# EAGLE design pcb_transformer_4x_balun (EAGLE 9.2.2)
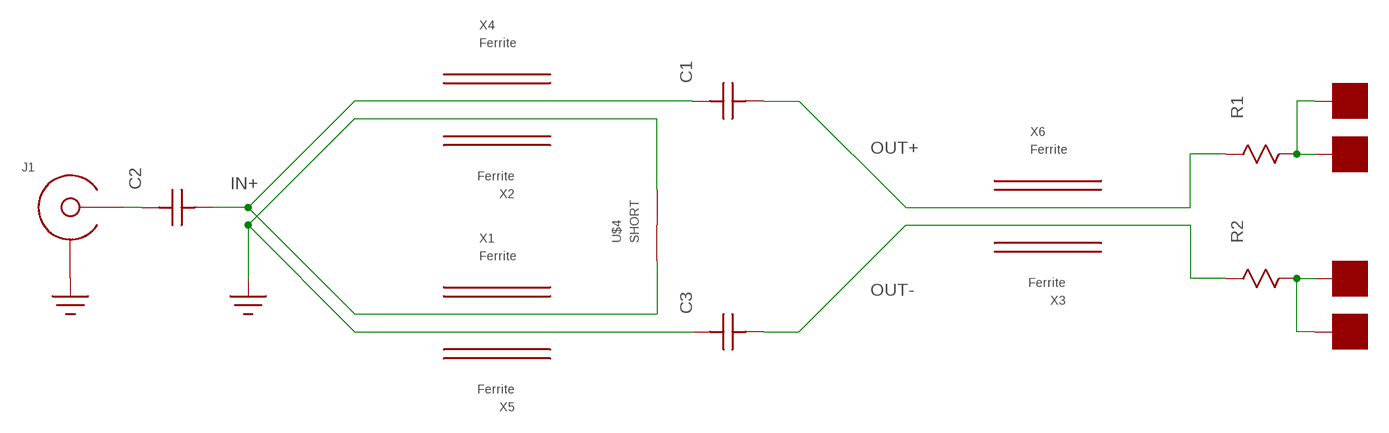
[diagram p0: schematic, sheet 1]

## Parts
C1  C0603  [C0603]
C2  C0603  [C0603]
C3  C0603  [C0603]
J1  EDGE_LAUNCH_JACK  [EDGE_LAUNCH_RF_CON]
R1  R0603  [R0603]
R2  R0603  [R0603]
U$2  PAD50MIL  [PAD_50MIL]
U$4  SHORT  [SHORT_57MIL]
U$5  PAD50MIL  [PAD_50MIL]
U$6  PAD50MIL  [PAD_50MIL]
U$7  PAD50MIL  [PAD_50MIL]
X1  Ferrite  FERRITE_PLATE  [FERRITE-MP0350]
X2  Ferrite  FERRITE_PLATE  [FERRITE-MP0350]
X3  Ferrite  FERRITE_PLATE  [FERRITE-MP0350]
X4  Ferrite  FERRITE_PLATE  [FERRITE-MP0350]
X5  Ferrite  FERRITE_PLATE  [FERRITE-MP0350]
X6  Ferrite  FERRITE_PLATE  [FERRITE-MP0350]

## Nets
GND: C3.P$2 J1.GND@1(SHIELD) J1.GND@2(SHIELD) J1.GND@3(SHIELD) J1.GND@4(SHIELD) J1.GND@5(SHIELD) J1.GND@6(SHIELD) J1.GND@7(SHIELD) J1.GND@8(SHIELD) J1.GND@9(SHIELD) J1.GND@10(SHIELD) J1.GND@11(SHIELD) J1.GND@12(SHIELD) J1.SHIELD@1(SHIELD) J1.SHIELD@2(SHIELD) U$4.P$2
IN+: C1.P$2 C2.P$1 U$4.P$1
N$2: C2.P$2 J1.CENTER
N$6: R1.P$2 U$2.P$1 U$6.P$1
N$7: R2.P$2 U$5.P$1 U$7.P$1
OUT+: C1.P$1 R1.P$1
OUT-: C3.P$1 R2.P$1

## Library data of the parts
C1-C3 = yapo:C
J1 = yapo:EDGE_LAUNCH_JACK
R1 R2 = yapo:R
U$2 U$5-U$7 = yapo:PAD
U$4 = yapo:SHORT
X1-X6 = yapo:FERRITE_PLATE

## Board
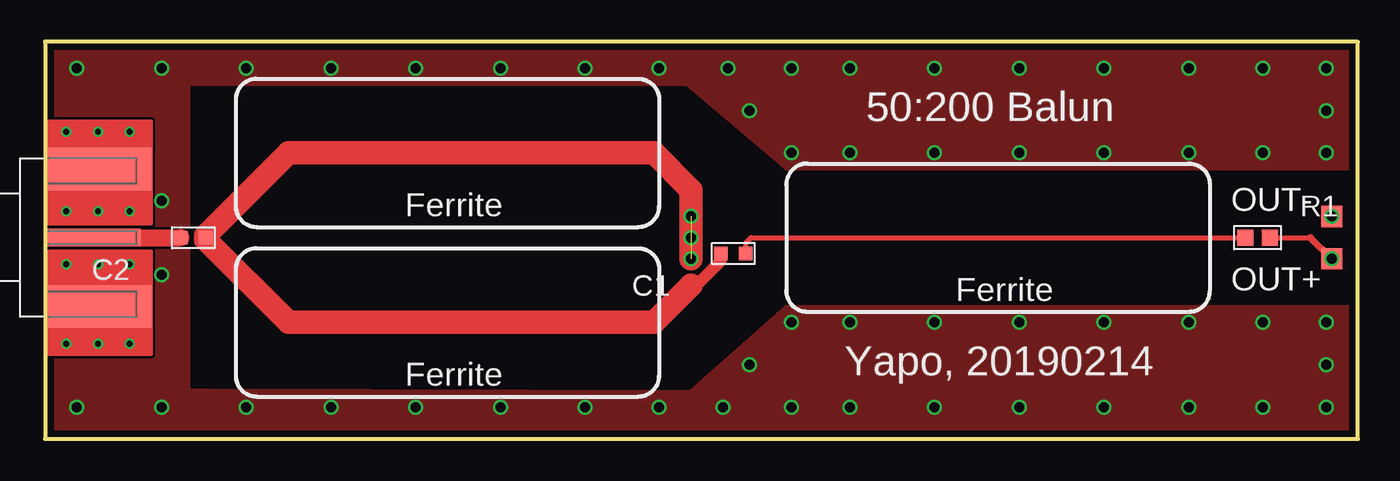
[diagram p1: board, top side]
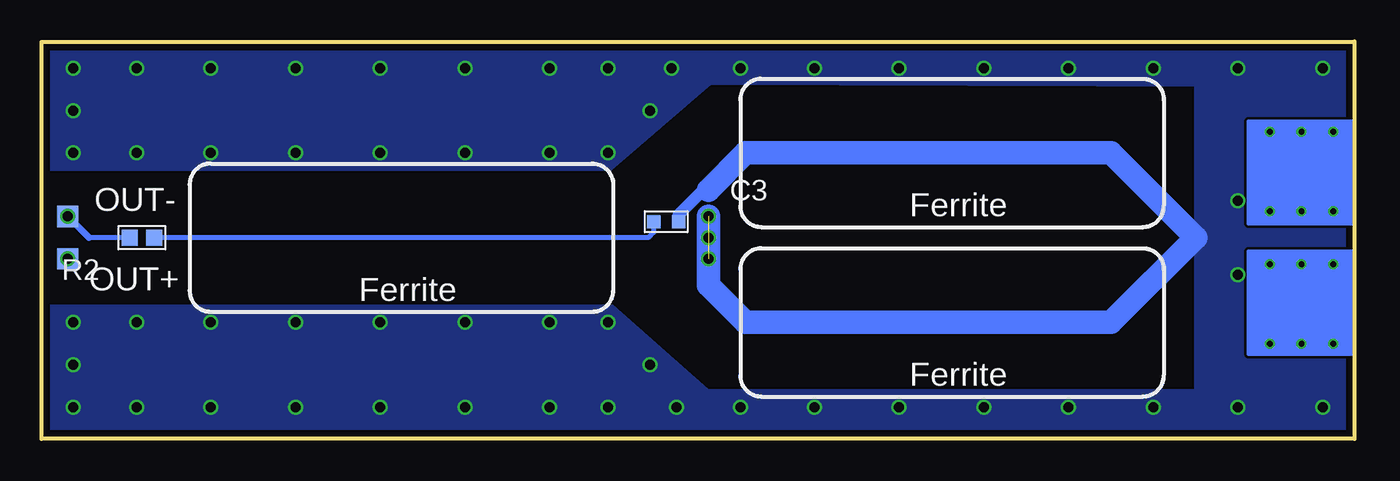
[diagram p2: board, bottom side, seen from below]

Size 78.72 x 23.81 mm. Coordinates in mm from the lower left corner, seen from the top.
Outline: 0,23.8 78.72,23.8 78.72,0 0,0 0,23.81
Copper layers (1*16): Top 0.035559375mm / dielectric 1.6mm / Bottom 0.035559375mm
Design rules "oshpark-2layer *": minimum track width 6mil, minimum drill 10mil, track to track 6mil, track to pad 6mil, pad to pad 6mil, via to via 6mil, smd to smd 6mil, copper to edge 15mil, drill to drill 6mil, minimum pad ring 5mil, minimum via ring 5mil, stop-mask expansion 2.5mil, vias tented up to drill 50mil, thermal gap 10mil

### Footprints (pad centres in the part's own frame; a part is rotated, then mirrored left to right if it is on the bottom)
C0603 = smd 0.8 x 0.8: P$1 -0.75,0; P$2 0.75,0
EDGE_LAUNCH_RF_CON = smd 5.715 x 1.041: CENTER -2.875,0 | drill 0.35: GND@1 -5.08,1.587; GND@2 -3.175,1.587; GND@3 -1.27,1.587; GND@4 -5.08,-1.587; GND@5 -3.175,-1.587; GND@6 -1.27,-1.587; GND@7 -5.08,6.35; GND@8 -3.175,6.35; GND@9 -1.27,6.35; GND@10 -5.08,-6.35; GND@11 -3.175,-6.35; GND@12 -1.27,-6.35 | smd 6.35 x 2.54: SHIELD@1 -3.175,-4.128; SHIELD@2 -3.175,4.128
R0603 = smd 0.95 x 0.95: P$1 -0.725,0; P$2 0.725,0
PAD_50MIL = smd 1.27 x 1.27: P$1 0,0
SHORT_57MIL = smd 0.127 x 0.127: P$1 -1.27,0; P$2 1.27,0 | drill 0.6: P$3 -1.27,0; P$4 0,0; P$5 1.27,0

### Placement (x,y rotation side)
C1  41.27,11.11 180 top
C2  8.89,12.06 180 top
C3  41.27,13.02 0 bottom
J1  0,12.06 180 top
R1  72.71,12.06 0 top
R2  72.71,12.06 180 bottom
U$2  77.15,10.79 0 top
U$4  38.73,12.06 270 top
U$5  77.15,13.34 0 bottom
U$6  77.15,10.79 0 bottom
U$7  77.15,13.34 0 top
X1  24.13,17.14 0 top
X2  57.15,12.06 0 bottom
X3  24.13,6.99 0 bottom
X4  24.13,17.14 0 bottom
X5  57.15,12.06 0 top
X6  24.13,6.99 0 top

### Tracks (layer width: path | path; a pad name or v marks a point on that pad's centre or on a via)
GND  (via drill 0.6)  (1 unrouted)
  Bottom 0.711: C3.P$2 40.52,13.45 39.05,14.92 38.73,14.92
  Bottom 1.397: 38.73,13.34 38.73,9.21 36.51,6.99 14.61,6.99 9.53,12.06 14.61,17.14 36.51,17.14 38.73,14.92
  other vias: 1.91,1.91 1.91,22.23 6.99,22.23 6.99,1.91 12.06,22.23 17.14,22.23 22.23,22.23 27.3,22.23 32.38,22.23 36.83,22.23 44.77,22.23 48.26,22.23 53.34,22.23 58.42,22.23 63.5,22.23 68.58,22.23 73.03,22.23 76.83,22.23 12.06,1.91 17.14,1.91 22.23,1.91 27.3,1.91 32.38,1.91 36.83,1.91 44.77,1.91 48.26,1.91 53.34,1.91 58.42,1.91 63.5,1.91 68.58,1.91 73.03,1.91 76.83,1.91 48.26,17.14 44.77,17.14 53.34,17.14 58.42,17.14 63.5,17.14 68.58,17.14 73.03,17.14 76.83,17.14 44.77,6.99 48.26,6.99 53.34,6.99 58.42,6.99 63.5,6.99 68.58,6.99 73.03,6.99 76.83,6.99 6.99,14.29 6.99,9.84 40.96,22.23 40.64,1.91 76.83,19.68 76.83,4.45 42.23,19.68 42.23,4.45
  pour Bottom: 0,24.13 9.53,24.13 9.53,0 0,0
  pour Bottom: 0,24.13 78.74,24.13 78.74,16.19 44.61,16.19 38.62,21.35 0,21.21
  pour Bottom: 38.8,2.88 44.49,7.94 78.74,7.94 78.74,0 0,0.31 -0.07,2.86
  pour Top: 0.32,2.94 38.7,2.84 44.46,7.94 78.74,7.94 78.74,0 0,0
  pour Top: 0,24.13 78.74,24.13 78.74,16.19 44.48,16.19 38.49,21.26 0,21.22
  pour Top: 0.32,23.5 8.57,23.5 8.57,0.32 0.32,0.32
IN+
  Top 0.711: C1.P$2 40.52,10.68 39.05,9.21 38.73,9.21
  Top 1.016: 9.64,12.18 C2.P$1 9.64,11.95
  Top 1.397: 9.64,12.18 14.61,17.14 36.51,17.14 38.73,14.92 U$4.P$1 | 9.64,11.95 14.61,6.99 36.51,6.99 38.73,9.21
N$2
  Top 1.016: J1.CENTER C2.P$2
N$6  (via drill 0.6)
  Top 0.305: R1.P$2 75.88,12.06
  Top 0.406: U$6.P$1 75.88,12.06
  other vias: 77.15,10.79
N$7  (via drill 0.6)
  Bottom 0.305: R2.P$2 75.88,12.06
  Bottom 0.406: U$7.P$1 75.88,12.06
  other vias: 77.15,13.34
OUT+
  Top 0.305: C1.P$1 42.02,11.75 42.34,12.06 R1.P$1
OUT-
  Bottom 0.305: C3.P$1 42.02,12.38 42.34,12.06 R2.P$1

### Text on the board
tPlace: 50:200 Balun | OUT- | OUT+ | Yapo, 20190214
bPlace: OUT- | OUT+